# Altium project ultrasonic_ranging.PrjPcb
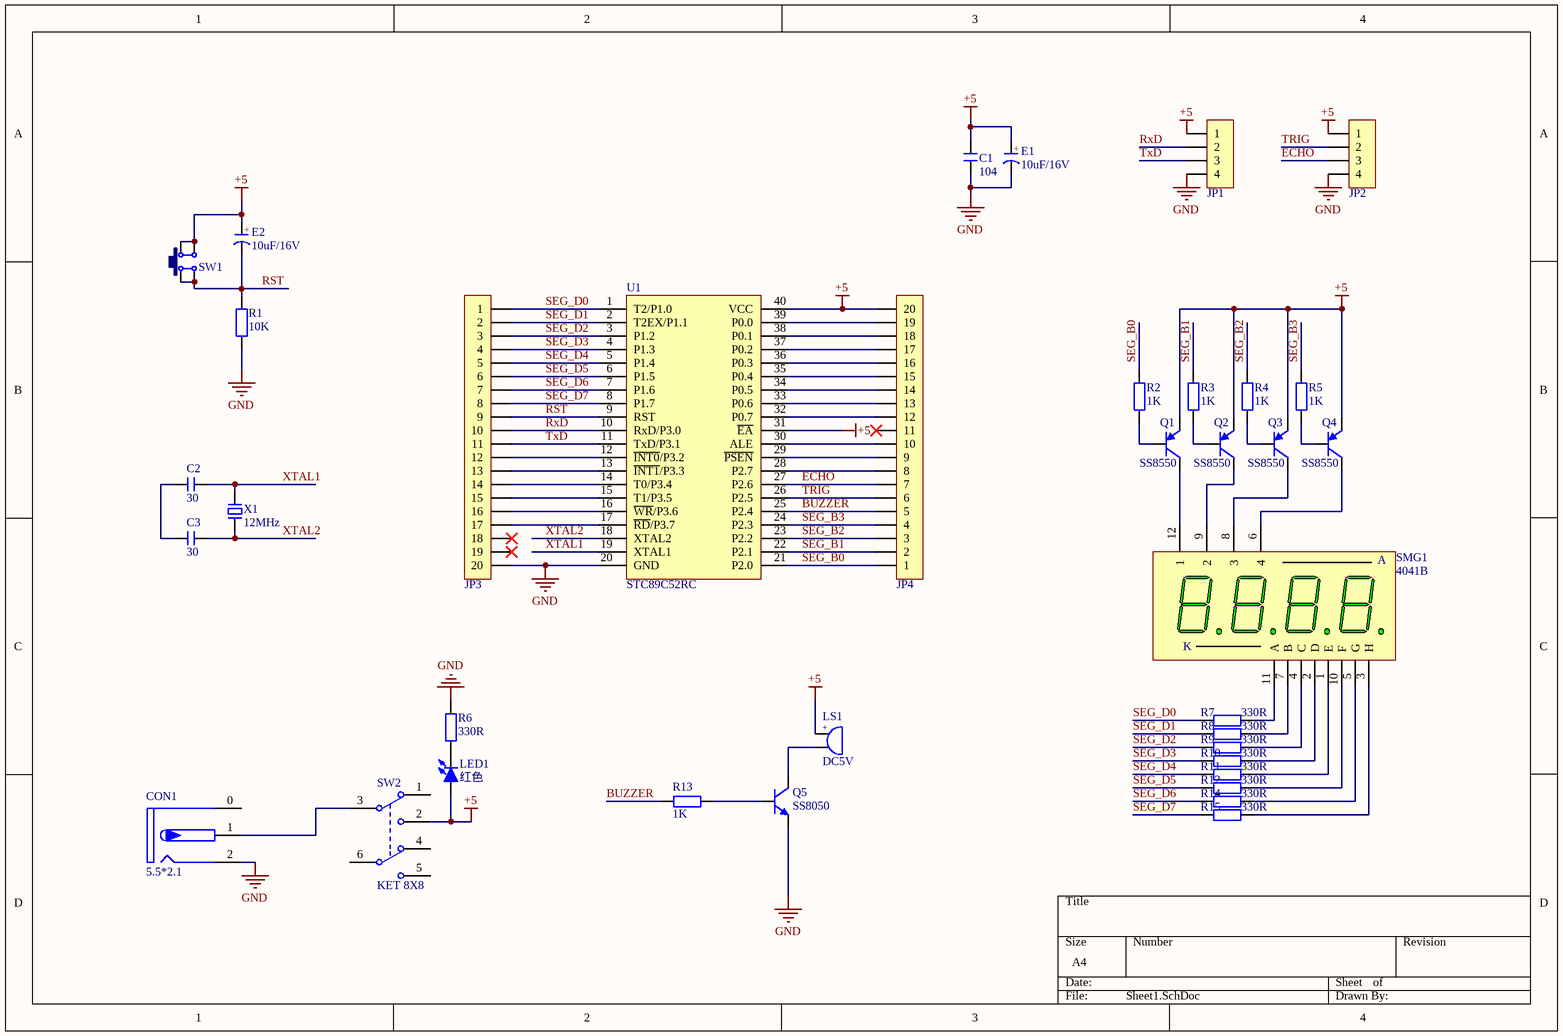
[diagram p0: Sheet1.SchDoc]
1 sheet, 37 parts. Net scope: global (net labels, ports and power ports of the same name join across sheets).
Board file: PCB1.PcbDoc

## Sheet Sheet1.SchDoc
size A4

### Parts
C1  104  [C 0805_M]
C2  30  [CC 2.2*5]
C3  30  [CC 2.2*5]
CON1  5.5*2.1  [DC-005]
E1  10uF/16V  [CAP 3.5*8*11.5]
E2  10uF/16V  [CAP 2.0*5*11 - GD]
JP1  HDR-1X4  [HDR2.54-LI-4P]  (value not drawn)
JP2  HDR-1X4  [HDR2.54-LI-4P]  (value not drawn)
JP3  HDR-1X20  [HDR2.54-M-LI-20P]  (value not drawn)
JP4  HDR-1X20  [HDR2.54-M-LI-20P]  (value not drawn)
LED1  红色  [LED 5MM-R]
LS1  DC5V  [BEEP 7.6X12X9.5]
Q1  SS8550  [SOT23-3M]
Q2  SS8550  [SOT23-3M]
Q3  SS8550  [SOT23-3M]
Q4  SS8550  [SOT23-3M]
Q5  SS8050  [TO92A]
R1  10K  [RS 1/4W]
R2  1K  [RS 1/4W]
R3  1K  [RS 1/4W]
R4  1K  [RS 1/4W]
R5  1K  [RS 1/4W]
R6  330R  [RS 1/4W]
R7  330R  [RS 1/4W]
R8  330R  [RS 1/4W]
R9  330R  [RS 1/4W]
R10  330R  [RS 1/4W]
R11  330R  [RS 1/4W]
R12  330R  [RS 1/4W]
R13  1K  [RS 1/4W]
R14  330R  [RS 1/4W]
R15  330R  [RS 1/4W]
SMG1  4041B  [SMG 0.4-4P]
SW1  6x6x5  [TSW DIP-6*6*5]  (value not drawn)
SW2  KET 8X8  [KFT DIP-8X8]
U1  STC89C52RC  [DIP40-600]
X1  12MHz  [OSC HC-49S]

### Nets
+5: C1.2 E1.1(A) E2.1(A) JP1.1 JP2.1 JP4.20 LED1.1(A) LS1.1 Q1.2(E) Q2.2(E) Q3.2(E) Q4.2(E) SW1.2 SW1.3 SW2.2(COM2) U1.31(~{EA}) U1.40(VCC)
GND: C1.1 CON1.2 E1.2(K) JP1.4 JP2.4 JP3.20 Q5.1(E) R1.1 R6.2 U1.20(GND)
BUZZER: JP4.5 R13.1 U1.25(P2.4)
ECHO: JP2.3 JP4.7 U1.27(P2.6)
RST: E2.2(K) JP3.9 R1.2 SW1.1 SW1.4 U1.9(RST)
RxD: JP1.2 JP3.10 U1.10(RxD/P3.0)
SEG_B0: JP4.1 R2.2 U1.21(P2.0)
SEG_B1: JP4.2 R3.2 U1.22(P2.1)
SEG_B2: JP4.3 R4.2 U1.23(P2.2)
SEG_B3: JP4.4 R5.2 U1.24(P2.3)
SEG_D0: JP3.1 R7.1 U1.1(T2/P1.0)
SEG_D1: JP3.2 R8.1 U1.2(T2EX/P1.1)
SEG_D2: JP3.3 R9.1 U1.3(P1.2)
SEG_D3: JP3.4 R10.1 U1.4(P1.3)
SEG_D4: JP3.5 R11.1 U1.5(P1.4)
SEG_D5: JP3.6 R12.1 U1.6(P1.5)
SEG_D6: JP3.7 R14.1 U1.7(P1.6)
SEG_D7: JP3.8 R15.1 U1.8(P1.7)
TRIG: JP2.2 JP4.6 U1.26(P2.5)
TxD: JP1.3 JP3.11 U1.11(TxD/P3.1)
XTAL1: C2.2 U1.19(XTAL1) X1.2
XTAL2: C3.2 U1.18(XTAL2) X1.1
NetC2_1: C2.1 C3.1
NetCON1_1: CON1.1 SW2.3(NO1)
NetJP3_12: JP3.12 U1.12(~{INT0}/P3.2)
NetJP3_13: JP3.13 U1.13(~{INT1}/P3.3)
NetJP3_14: JP3.14 U1.14(T0/P3.4)
NetJP3_15: JP3.15 U1.15(T1/P3.5)
NetJP3_16: JP3.16 U1.16(~{WR}/P3.6)
NetJP3_17: JP3.17 U1.17(~{RD}/P3.7)
NetJP4_8: JP4.8 U1.28(P2.7)
NetJP4_9: JP4.9 U1.29(~{PSEN})
NetJP4_10: JP4.10 U1.30(ALE)
NetJP4_12: JP4.12 U1.32(P0.7)
NetJP4_13: JP4.13 U1.33(P0.6)
NetJP4_14: JP4.14 U1.34(P0.5)
NetJP4_15: JP4.15 U1.35(P0.4)
NetJP4_16: JP4.16 U1.36(P0.3)
NetJP4_17: JP4.17 U1.37(P0.2)
NetJP4_18: JP4.18 U1.38(P0.1)
NetJP4_19: JP4.19 U1.39(P0.0)
NetLED1_2: LED1.2(K) R6.1
NetLS1_2: LS1.2 Q5.3(C)
NetQ1_1: Q1.1(B) R2.1
NetQ1_3: Q1.3(C) SMG1.12(1)
NetQ2_1: Q2.1(B) R3.1
NetQ2_3: Q2.3(C) SMG1.9(2)
NetQ3_1: Q3.1(B) R4.1
NetQ3_3: Q3.3(C) SMG1.8(3)
NetQ4_1: Q4.1(B) R5.1
NetQ4_3: Q4.3(C) SMG1.6(4)
NetQ5_2: Q5.2(B) R13.2
NetR7_2: R7.2 SMG1.11(A)
NetR8_2: R8.2 SMG1.7(B)
NetR9_2: R9.2 SMG1.4(C)
NetR10_2: R10.2 SMG1.2(D)
NetR11_2: R11.2 SMG1.1(E)
NetR12_2: R12.2 SMG1.10(F)
NetR14_2: R14.2 SMG1.5(G)
NetR15_2: R15.2 SMG1.3(H)

Not connected (* = marked no-connect by the designer): CON1 0; JP3 18* 19*; JP4 11*; SW2 1(NC1) 4(NO2) 5(COM2) 6(NC2)

### Notes on the sheet
- (in symbol 4041B) K
- (in symbol BEEP) +
- (in symbol C-CAP) +

### Library data of the parts
C1 = C: 无极性贴片电容; 版权归属: 源创客; BOM名称: 无极性贴片电容; 学习资源: www.ooocke.com
C2 C3 = C-CC: 直插瓷片电容; 版权归属: 源创客; BOM名称: 直插瓷片电容; 学习资源: www.ooocke.com
CON1 = DC-005P: 带屏蔽DC电源接口; 版权归属: 源创客; BOM名称: 带屏蔽DC电源接口; 学习资源: www.ooocke.com
E1 E2 = C-CAP: 直插电解电容; 版权归属: 源创客; BOM名称: 直插电解电容; 学习资源: www.ooocke.com
JP1 JP2 = Header 4: 4P接插件; 版权归属: 源创客; BOM名称: 4P接插件; 学习资源: www.ooocke.com
JP3 JP4 = Header 20: 20P接插件; 版权归属: 源创客; BOM名称: 20P接插件; 学习资源: www.ooocke.com
LED1 = LED-5MM: 5mm插件LED; 版权归属: 源创客; BOM名称: 5mm插件LED; 学习资源: www.ooocke.com
LS1 = BEEP: 蜂鸣器; 版权归属: 源创客; BOM名称: 蜂鸣器; 学习资源: www.ooocke.com
Q1-Q4 = 8550-SMD: 高频放大-PNP型; 版权归属: 源创客; 属性: 40V 1.5A 1W 100MHZ; BOM名称: 高频放大-PNP型; 学习资源: www.ooocke.com
Q5 = 8050-DIP: 高频放大-NPN型; 版权归属: 源创客; 属性: 40V 1.5A 1W 100MHZ; BOM名称: 高频放大-NPN型; 学习资源: www.ooocke.com
R1-R15 = R-CRR: 直插色环电阻; BOM名称: 色环电阻; 版权归属: 源创客; 学习资源: www.ooocke.com
SMG1 = 4041B: 0.4寸4位共阳数码管; 版权归属: 源创客; BOM名称: 0.4寸4位共阳; 学习资源: www.ooocke.com
SW1 = TSW DIP-6x6: 直插6x6轻触开关; 版权归属: 源创客; BOM名称: 直插6x6轻触开关; 学习资源: www.ooocke.com
SW2 = KET 8X8: 8*8自锁开关; 版权归属: 源创客; BOM名称: 8*8自锁开关; 学习资源: www.ooocke.com
U1 = STC89C52RC: STC单片机; 版权归属: 源创客; BOM名称: STC单片机; 学习资源: www.ooocke.com
X1 = XTAL-2P: 2脚无源脚晶振; 版权归属: 源创客; BOM名称: 2脚无源脚晶振; 学习资源: www.ooocke.com